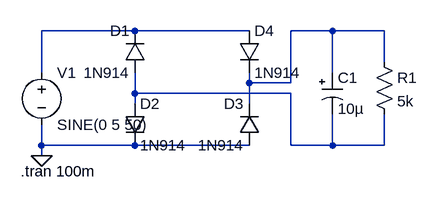
[diagram p0: schematic 2_1.asc]
2_1.asc, the LTspice schematic file:
Version 4
SHEET 1 880 680
WIRE 208 16 64 16
WIRE 384 16 208 16
WIRE 512 16 448 16
WIRE 592 16 512 16
WIRE 592 64 592 16
WIRE 64 80 64 16
WIRE 512 80 512 16
WIRE 384 96 384 80
WIRE 448 96 448 16
WIRE 448 96 384 96
WIRE 208 112 208 80
WIRE 448 112 208 112
WIRE 208 128 208 112
WIRE 384 128 384 96
WIRE 64 192 64 160
WIRE 208 192 64 192
WIRE 384 192 208 192
WIRE 448 192 448 112
WIRE 512 192 512 144
WIRE 512 192 448 192
WIRE 592 192 592 144
WIRE 592 192 512 192
WIRE 64 208 64 192
FLAG 64 208 0
SYMBOL voltage 64 64 R0
WINDOW 123 0 0 Left 2
WINDOW 39 0 0 Left 2
SYMATTR InstName V1
SYMATTR Value SINE(0 5 50)
SYMBOL diode 224 80 R180
WINDOW 0 24 64 Left 2
WINDOW 3 24 0 Left 2
SYMATTR InstName D1
SYMATTR Value 1N914
SYMBOL diode 192 128 R0
SYMATTR InstName D2
SYMATTR Value 1N914
SYMBOL diode 400 192 R180
WINDOW 0 24 64 Left 2
WINDOW 3 24 0 Left 2
SYMATTR InstName D3
SYMATTR Value 1N914
SYMBOL diode 368 16 R0
SYMATTR InstName D4
SYMATTR Value 1N914
SYMBOL polcap 496 80 R0
WINDOW 3 24 56 Left 2
SYMATTR Value 10µ
SYMATTR InstName C1
SYMATTR Description Capacitor
SYMATTR Type cap
SYMATTR SpiceLine V=10 Irms=2.21565 Rser=0.055 Lser=0 mfg="KEMET" pn="A700V106M010ATE055" type="Al electrolytic"
SYMBOL res 576 48 R0
SYMATTR InstName R1
SYMATTR Value 5k
TEXT 32 232 Left 2 !.tran 100m

The netlist it stands for:
* 2_1.asc
V1 N001 0 SINE(0 5 50)
D1 N003 N001 1N914
D2 N003 0 1N914
D3 0 N002 1N914
D4 N001 N002 1N914
C1 N002 N003 10µ V=10 Irms=2.21565 Rser=0.055 Lser=0 mfg="KEMET" pn="A700V106M010ATE055" type="Al electrolytic"
R1 N002 N003 5k
.model D D
.lib standard.dio
.tran 100m
.backanno
.end